# EAGLE design Lilypad_Power_Supply (EAGLE 7.2.0)
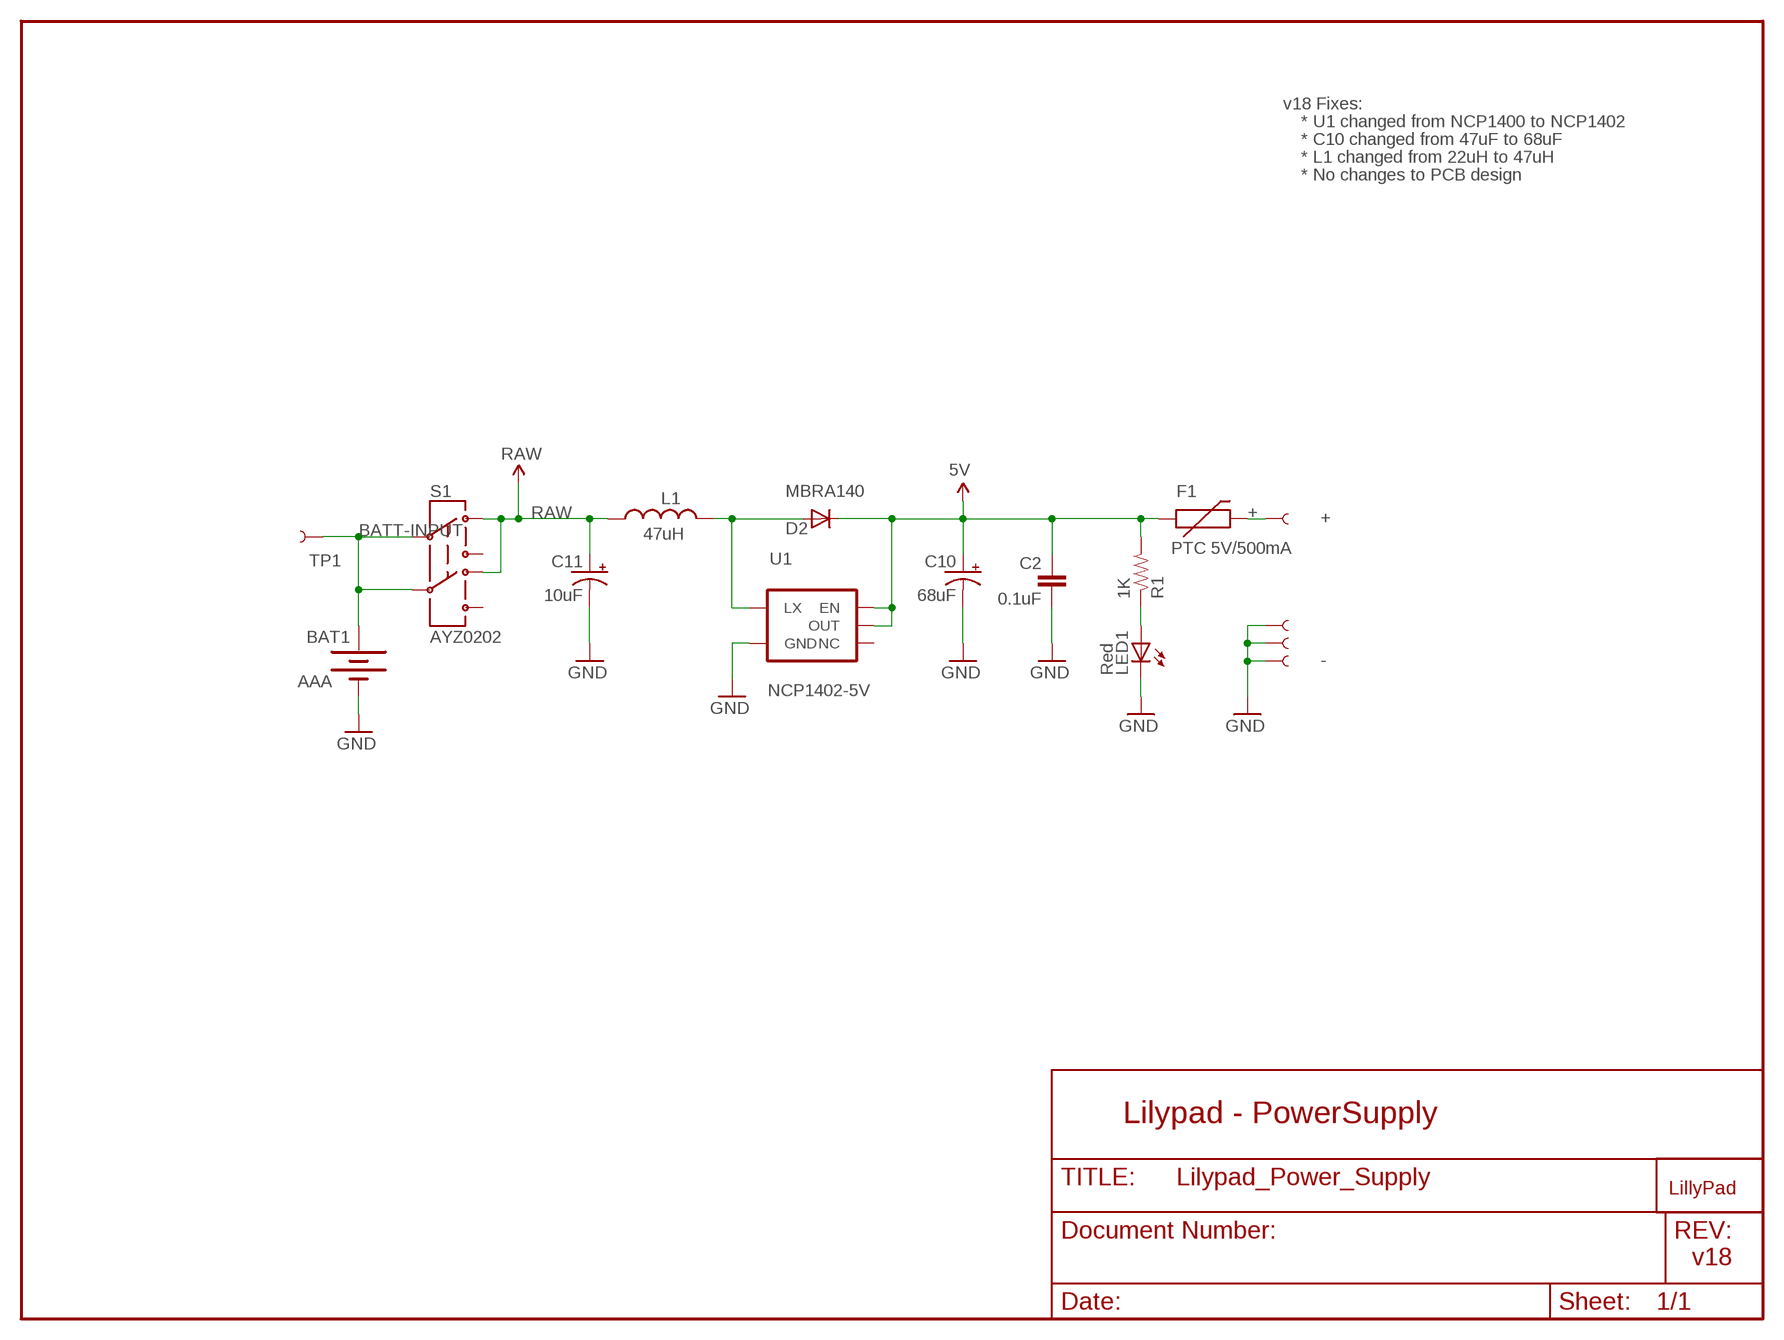
[diagram p0: schematic, sheet 1]

## Parts
BAT1  AAA  BATTERYAAA  [BATTERY-AAA]
C2  0.1uF  CAP0603-CAP  [0603-CAP]
C10  68uF  CAP_POL2  [EIA3528-21]
C11  10uF  CAP_POL1206  [CPOL_1206]
D2  MBRA140  DIODESMA  [SMA-DIODE]
F1  PTC 5V/500mA  PTCSMD  [PTC-1206]
L1  47uH  INDUCTORCR54  [CR54]
LED1  Red  LED1206  [LED-1206]
R1  1K  RESISTOR0603-RES  [0603-RES]
S1  AYZ0202  [AYZ0202]
TP1  TEST-POINT3X5  [PAD.03X.05]
U1  NCP1402-5V  V_REG_NCP1400SOT23-5  [SOT23-5]
U$1  SEWTAP10  [PETAL-LONG-2-2SIDE]
U$2  SEWTAP10  [PETAL-LONG-2-2SIDE]
U$4  SEWTAP10  [PETAL-LONG-2-2SIDE]
U$5  SEWTAP10  [PETAL-LONG-2-2SIDE]
U$7  LOGO-LPLP  [LOGO-LILYPAD]

## Nets
5V: C2.1 C10.A(+) D2.C F1.1 R1.2 U1.1(EN) U1.2(OUT)
+: F1.2 U$1.1
BATT-INPUT: BAT1.PWR@1(+) S1.2 S1.5 TP1.P$1
GND: BAT1.GND@1(-) C2.2 C10.C(-) C11.C(-) LED1.C U1.4(GND) U$2.1 U$4.1 U$5.1
N$1: LED1.A R1.1
N$16: D2.A L1.P$1 U1.5(LX)
RAW: C11.A(+) L1.P$2 S1.3 S1.6
Unconnected: S1.1 S1.4 U1.3(NC)

## Notes on the sheet
- v18 Fixes:
- * U1 changed from NCP1400 to NCP1402
- * C10 changed from 47uF to 68uF
- * L1 changed from 22uH to 47uH
- * No changes to PCB design
- +
- -
- Lilypad - PowerSupply
- v18

## Library data of the parts
BAT1 = SparkFun:BATTERY: Battery Holders Various common sizes : AA, AAA, 20mm coin cell and 12mm coin cell.
C2 = SparkFun:CAP: Capacitor Standard 0603 ceramic capacitor, and 0.1" leaded capacitor.
C10 C11 = SparkFun-Nate:CAP_POL
D2 = SparkFun-Nate:DIODE
F1 = SparkFun:PTC: Resettable Fuse PTC Resettable Fuse. Spark Fun Electronics SKU : COM-08357
L1 = SparkFun-Nate:INDUCTOR: Basic Inductor/Choke - 0603 and 1206
LED1 = SparkFun:LED: LEDs Standard schematic elements and footprints for 5mm, 3mm, 1206, and 0603 sized LEDs. 5mm - Spark Fun Electronics SKU : COM-00529 (and others)
R1 = SparkFun:RESISTOR: Resistor Basic schematic elements and footprints for 0603, 1206, and PTH resistors.
S1 = SparkFun:AYZ0202: SPDT Slide Switch Simple SMD single-pull double-throw slide switch. Good for less than 350mA power switch, switching UARTs between devices, etc. Spark Fun Electronics SKU : COM-00597
TP1 = SparkFun:TEST-POINT
U1 = SparkFun:V_REG_NCP1400: Switching step-up voltage regulator NCP1400 switiching regulator takes single cell AA and outputs 100mA at 3.3V or 5V with minimal number of external components.
U$1 U$2 U$4 U$5 = LilyPad-Wearables:SEWTAP
U$7 = LilyPad-Wearables:LOGO-LP

## Net classes
0 Default: width 0.203 mm
1 Power: width 0.305 mm
3 ButtonSignal: width 0.203 mm

## Board
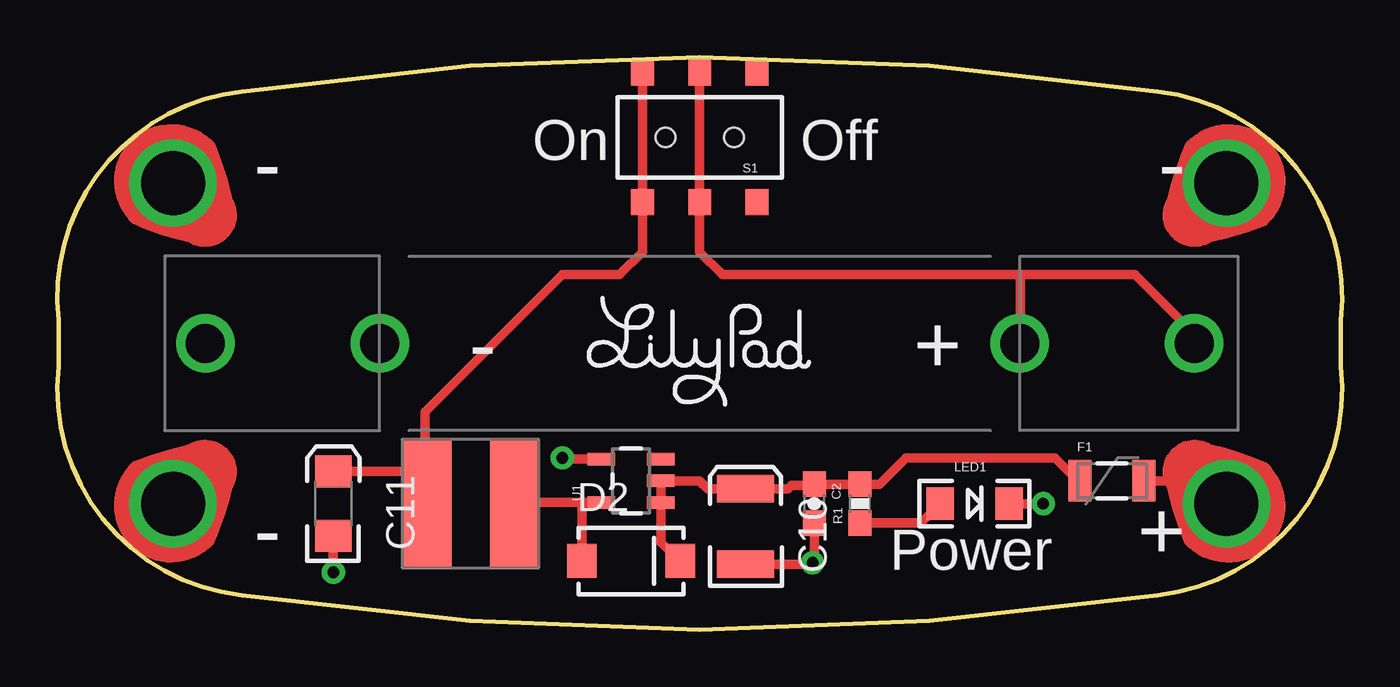
[diagram p1: board, top side]
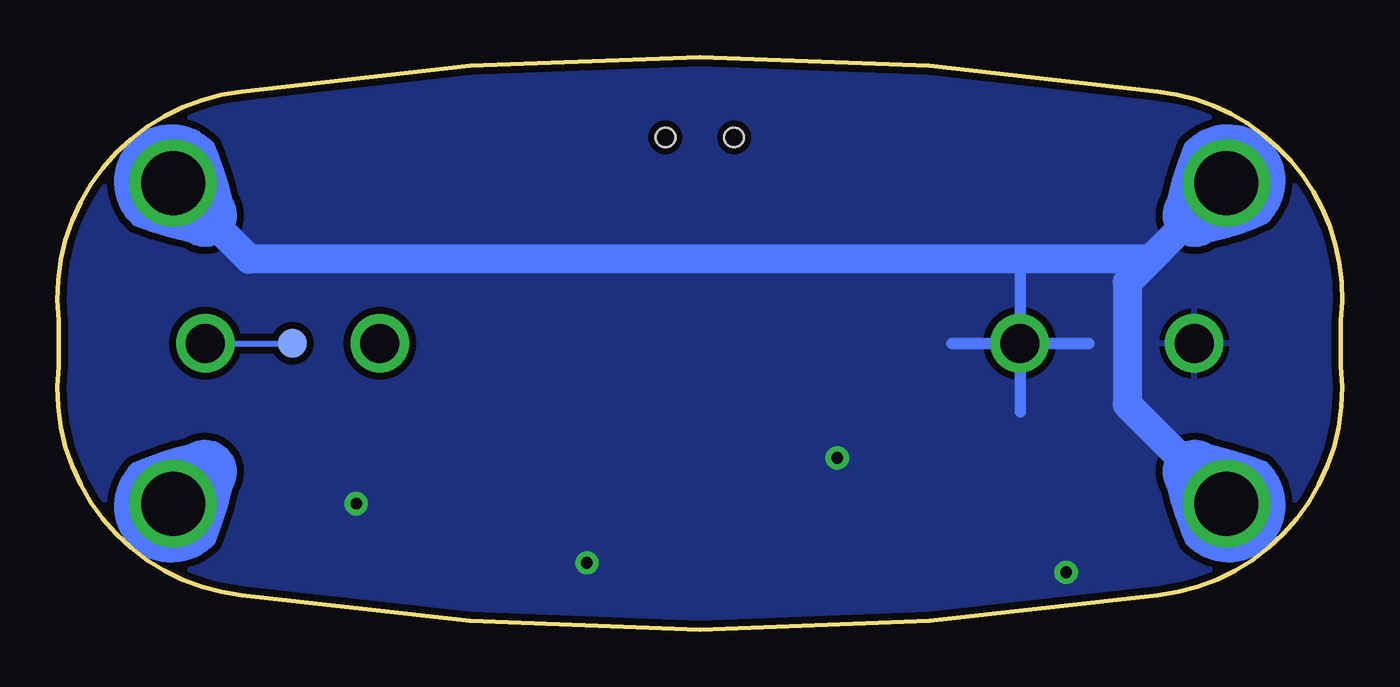
[diagram p2: board, bottom side, seen from below]

Size 56.11 x 25 mm. Coordinates in mm from the lower left corner, seen from the top.
Outline: 48.05,23.5 arc-90 56.05,13.5 56.05,11.5 arc-90 48.05,1.5 arc-17 8.05,1.5 arc-90 0.05,11.5 0.05,13.5 arc-90 8.05,23.5 arc-17 48.05,23.5
Copper layers (1*16): Top 0.035mm / dielectric 1.5mm / Bottom 0.035mm
Design rules "default": minimum track width 8mil, minimum drill 20mil, track to track 8mil, track to pad 8mil, pad to pad 8mil, via to via 8mil, smd to smd 8mil, copper to edge 10mil, drill to drill 8mil, minimum pad ring 12mil, minimum via ring 10mil, stop-mask expansion 4mil, vias tented up to drill 20mil, thermal gap 10mil

### Footprints (pad centres in the part's own frame; a part is rotated, then mirrored left to right if it is on the bottom)
BATTERY-AAA = drill 1.702: GND@1 21.59,0; GND@2 13.97,0; PWR@1 -21.59,0; PWR@2 -13.97,0
0603-CAP = smd 1.1 x 1: 1 -0.85,0; 2 0.85,0
EIA3528-21 = smd 2.5 x 1.2: A 0,-1.65; C 0,1.65
CPOL_1206 = smd 1.6 x 1.4: A 0,-1.4; C 0,1.4
SMA-DIODE = smd 1.27 x 1.47: A -2.15,0; C 2.15,0
PTC-1206 = smd 1 x 1.8: 1 -1.4,0; 2 1.4,0
CR54 = smd 5.5 x 2.15: P$1 0,1.92; P$2 0,-1.92
LED-1206 = smd 1.2 x 1.4: A -1.5,0; C 1.5,0
0603-RES = smd 1.1 x 1: 1 -0.85,0; 2 0.85,0
AYZ0202 = smd 1 x 1.15: 1 -2.5,2.825; 2 0,2.825; 3 2.5,2.825; 4 -2.5,-2.825; 5 0,-2.825; 6 2.5,-2.825 | hole 0.85: 1.5,0; -1.5,0
PAD.03X.05 = smd 1.27 x 1.27: P$1 0,0
SOT23-5 = smd 0.55 x 1.2: 1 -0.95,-1.3; 2 0,-1.3; 3 0.95,-1.3; 4 0.95,1.3; 5 -0.95,1.3
PETAL-LONG-2-2SIDE = drill 2.794: 1 0,0

### Placement (x,y rotation side)
BAT1  28.05,12.5 180 top
C2  33.05,5.5 270 top
C10  30.05,4.5 180 top
C11  12.05,5.5 180 top
D2  25.05,3 0 top
F1  46.05,6.5 0 top
L1  18.05,5.5 270 top
LED1  40.05,5.5 0 top
R1  35.05,5.5 90 top
S1  28.05,21.5 180 top
TP1  45.83,12.5 0 bottom
U1  25.05,6.5 90 top
U$1  51.05,5.5 45 top
U$2  5.05,19.5 225 top
U$4  51.05,19.5 135 top
U$5  5.05,5.5 315 top
U$7  28.05,12.5 0 top

### Tracks (layer width: path | path; a pad name or v marks a point on that pad's centre or on a via)
5V
  Top 0.406: U1.1 26.35,5.5 | U1.1 U1.2 28.05,6.5 28.4,6.15 C10.A 31.9,6.15 32.05,6.3 33.15,6.3 33.1,6.35 C2.1 35,6.35 35.05,6.4 R1.2 35.9,6.35 37.05,7.5 43.55,7.5 44.65,6.4 F1.1 | 26.35,5.5 | 27.15,2.5 D2.C 27.15,3 26.35,3.8 U1.1
+
  Top 0.406: U$1.1 51.15,5.6 50.25,6.5 F1.2
BATT-INPUT
  Top 0.406: S1.2 28.05,18.5 | S1.2 S1.5 | 42.05,15.5 47.05,15.5 49.65,12.9 BAT1.PWR@1 | 42.05,15.5 42.05,12.5 | S1.2 28.05,16.5 29.05,15.5 42.05,15.5
  Bottom 0.254: BAT1.PWR@1 TP1.P$1
GND  (via drill 0.51)
  Top 0.406: C11.C v12.05,2.5 | U1.4 22.1,7.45 v22.05,7.5 | LED1.C v43.05,5.5 | v32.97,2.91 32.95,2.9 | v32.97,2.91 v32.98,2.91 32.98,2.93 33.05,3 | C2.2 33.05,3 | 33.05,3 v32.97,2.91 | C10.C 32.9,2.85 33.05,3
  Bottom 0.508: 17.05,12.5 11.05,12.5 | 14.05,15.5 14.05,9.5
  Bottom 1.27: U$5.1 9.39,9.83 9.39,15.17 7.99,16.57 | 7.99,16.57 U$2.1 | U$4.1 47.74,16.18 8.37,16.18 7.99,16.57
  pour Bottom (isolate 0.305): 0.05,25.5 56.05,25.5 56.05,-0.5 0.05,-0.5
N$1
  Top 0.406: R1.1 37.7,4.65 LED1.A
N$16
  Top 0.406: L1.P$1 20.05,5.5 20.1,5.55 22.95,5.55 | U1.5 22.95,5.55 | 22.95,5.55 22.95,5.5 22.9,5.45 D2.A
RAW
  Top 0.406: L1.P$2 16.13,6.5 16.05,6.5 | C11.A 15.65,6.9 16.05,6.5 | 25.55,18.5 25.55,16.5 24.55,15.5 22.05,15.5 16.05,9.5 16.05,6.5 | 25.55,18.5 S1.3 | 25.55,18.5 S1.6

### Text on the board
tPlace: - | - | On | Off | - | + | Power
tValues: AAA Clip Points In | AAA Clip Points In | 22uH